# Altium project L4Duino.PrjPcb
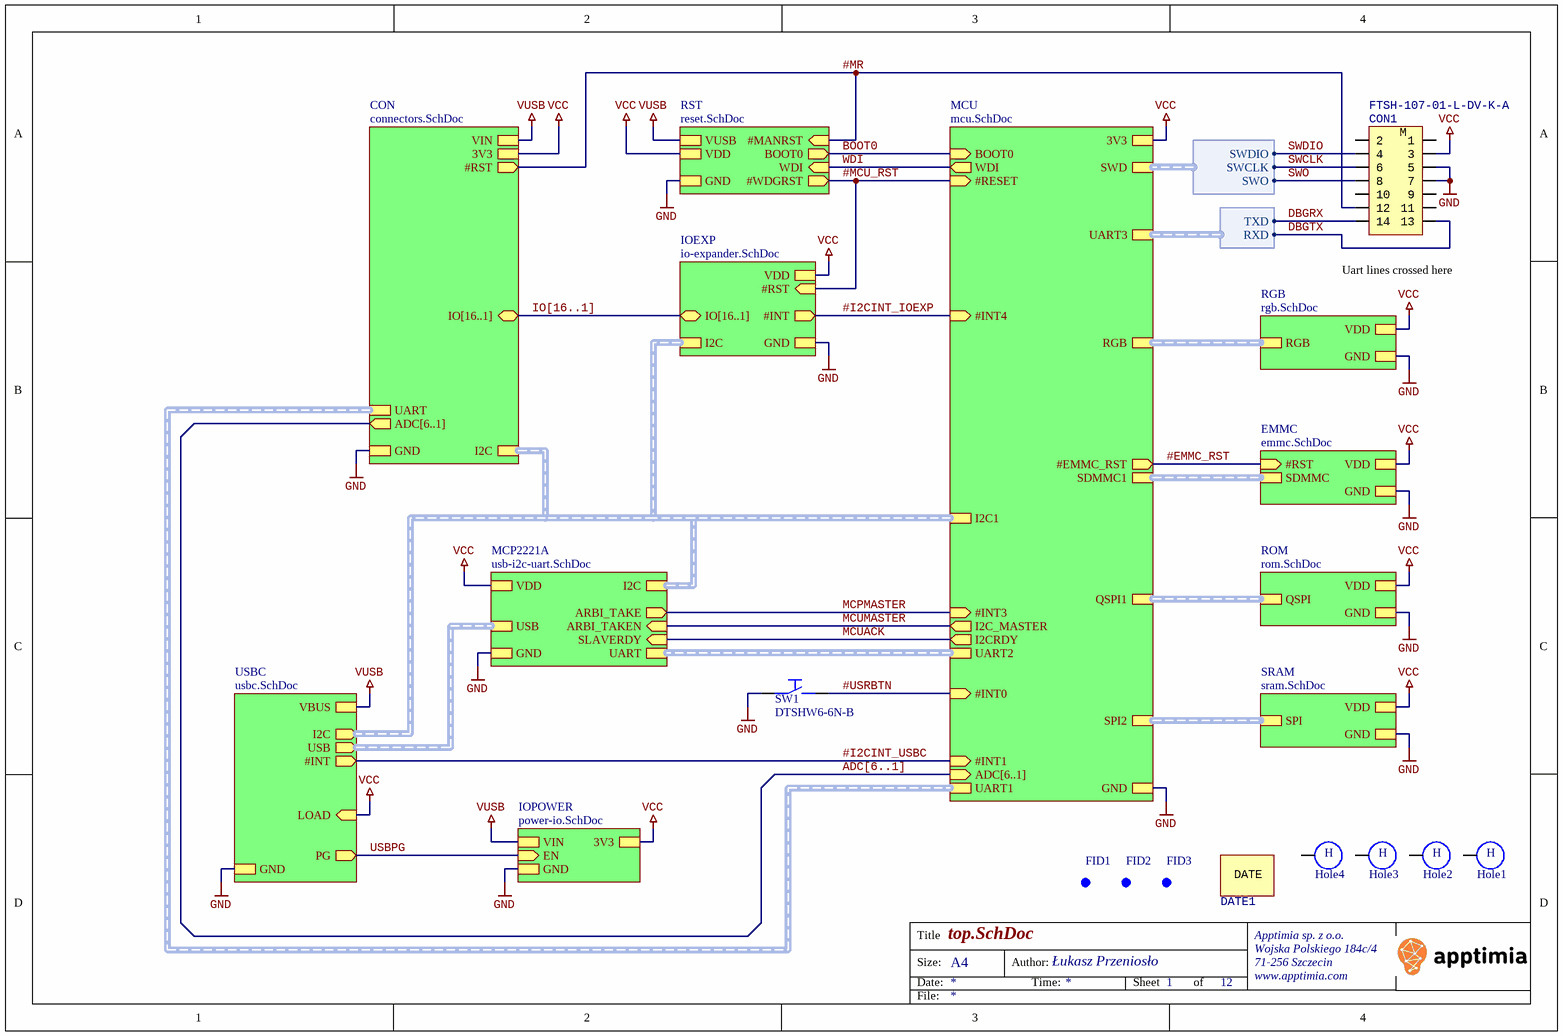
[diagram p0: top.SchDoc]
id: L4Duino; ver: 1
12 sheets, 106 parts. Net scope: strictly hierarchical (ports join the sheet entries above them; power ports are local).
Board file: L4Duino_ver1.PcbDoc
Sheets:
  top.SchDoc
    IOPOWER = power-io.SchDoc
    USBC = usbc.SchDoc
    MCP2221A = usb-i2c-uart.SchDoc
    SRAM = sram.SchDoc
    ROM = rom.SchDoc
    EMMC = emmc.SchDoc
    MCU = mcu.SchDoc
    CON = connectors.SchDoc
    RST = reset.SchDoc
    RGB = rgb.SchDoc
    IOEXP = io-expander.SchDoc

## Sheet top.SchDoc: Test
size A4; DrawnBy: Łukasz Przeniosło; Organization: Apptimia sp. z o.o.; Address1: Wojska Polskiego 184c/4; Address2: 71-256 Szczecin; Address3: www.apptimia.com; DocumentNumber: 1; Revision: 1; SheetNumber: 1; SheetTotal: 12

### Parts
CON1  FTSH-107-01-L-DV-K-A  [CON_SAMTEC_FTSH-107-01-L-DV-K-A]
DATE1  DATE  [DATE]  (value not drawn)
FID1  Fiducial  [Fid Round]  (value not drawn)  (no BOM)
FID2  Fiducial  [Fid Round]  (value not drawn)  (no BOM)
FID3  Fiducial  [Fid Round]  (value not drawn)  (no BOM)
Hole1  Hole  [Hole-4/3.2]  (value not drawn)
Hole2  Hole  [Hole-4/3.2]  (value not drawn)
Hole3  Hole  [Hole-4/3.2]  (value not drawn)
Hole4  Hole  [Hole-4/3.2]  (value not drawn)
SW1  DTSHW6-6N-B  [FSM2J]

### Sub-sheets
CON = connectors.SchDoc: 3V3, VIN, GND, ADC[6..1] (out), I2C (harness I2C), UART (harness UART), #RST (out), IO[16..1] (bidir)
EMMC = emmc.SchDoc: VDD, GND, #RST (in), SDMMC (harness SDIO)
IOEXP = io-expander.SchDoc: GND, VDD, I2C (harness I2C), #RST (in), #INT (out), IO[16..1] (bidir)
IOPOWER = power-io.SchDoc: 3V3, GND, EN (in), VIN
MCP2221A = usb-i2c-uart.SchDoc: GND, VDD, I2C (harness I2C), UART (harness UART), USB (harness USB), ARBI_TAKE (out), ARBI_TAKEN (in), SLAVERDY (in)
MCU = mcu.SchDoc: UART2 (harness UART2), I2C1 (harness I2C1), UART3 (harness UART3), SWD (harness SWD), #RESET (in), UART1 (harness UART1), RGB (harness RGB), GND, 3V3, #INT0 (in), SPI2 (harness SPI2), BOOT0 (in), #EMMC_RST (out), WDI (out), ADC[6..1] (in), #INT1 (in), I2C_MASTER (out), QSPI1 (harness QSPI1), #INT3 (in), SDMMC1 (harness SDMMC1), #INT4 (in), I2CRDY (out)
RGB = rgb.SchDoc: RGB (harness RGB), GND, VDD
ROM = rom.SchDoc: GND, VDD, QSPI (harness QSPI)
RST = reset.SchDoc: GND, VDD, #MANRST (in), #WDGRST (out), WDI (in), BOOT0 (out), VUSB
SRAM = sram.SchDoc: GND, VDD, SPI (harness SPI)
USBC = usbc.SchDoc: USB (out, harness USB), I2C (out, harness I2C), #INT (out), GND, VBUS, PG (out), LOAD (in)

### Harnesses
SWD: SWCLK, SWDIO, SWO
UART3: RXD, TXD

### Nets
GND: CON1.5 CON1.7 SW1.1 ; sheet IOPOWER/GND, sheet USBC/GND, sheet MCP2221A/GND, sheet SRAM/GND, sheet ROM/GND, sheet EMMC/GND, sheet MCU/GND, sheet CON/GND, sheet RST/GND, sheet RGB/GND, sheet IOEXP/GND
VCC: CON1.3 ; sheet IOPOWER/3V3, sheet USBC/LOAD, sheet MCP2221A/VDD, sheet SRAM/VDD, sheet ROM/VDD, sheet EMMC/VDD, sheet MCU/3V3, sheet CON/3V3, sheet RST/VDD, sheet RGB/VDD, sheet IOEXP/VDD
VUSB: sheet IOPOWER/VIN, sheet USBC/VBUS, sheet CON/VIN, sheet RST/VUSB
#EMMC_RST: sheet EMMC/#RST, sheet MCU/#EMMC_RST
#I2CINT_IOEXP: sheet MCU/#INT4, sheet IOEXP/#INT
#I2CINT_USBC: sheet USBC/#INT, sheet MCU/#INT1
#MCU_RST: sheet MCU/#RESET, sheet RST/#WDGRST, sheet IOEXP/#RST
#MR: CON1.12 ; sheet CON/#RST, sheet RST/#MANRST
#USRBTN: SW1.2 ; sheet MCU/#INT0
BOOT0: sheet MCU/BOOT0, sheet RST/BOOT0
DBGRX: CON1.14 ; sheet MCU/UART3.TXD
DBGTX: CON1.13 ; sheet MCU/UART3.RXD
MCPMASTER: sheet MCP2221A/ARBI_TAKE, sheet MCU/#INT3
MCUACK: sheet MCP2221A/SLAVERDY, sheet MCU/I2CRDY
MCUMASTER: sheet MCP2221A/ARBI_TAKEN, sheet MCU/I2C_MASTER
SWCLK: CON1.6 ; sheet MCU/SWD.SWCLK
SWDIO: CON1.4 ; sheet MCU/SWD.SWDIO
SWO: CON1.8 ; sheet MCU/SWD.SWO
USBPG: sheet IOPOWER/EN, sheet USBC/PG
WDI: sheet MCU/WDI, sheet RST/WDI

Not connected (* = marked no-connect by the designer): CON1 1 2 9 10 11; Hole1 1; Hole2 1; Hole3 1; Hole4 1

### Buses and harness runs
bus ADC[6..1] = sheet CON/ADC[6..1] = sheet MCU/ADC[6..1]
bus IO[16..1] = sheet CON/IO[16..1] = sheet IOEXP/IO[16..1]
harness sheet CON/I2C = sheet IOEXP/I2C = sheet MCP2221A/I2C = sheet MCU/I2C1 = sheet USBC/I2C
harness sheet CON/UART = sheet MCU/UART1
harness sheet EMMC/SDMMC = sheet MCU/SDMMC1
harness sheet MCP2221A/UART = sheet MCU/UART2
harness sheet MCP2221A/USB = sheet USBC/USB
harness sheet MCU/QSPI1 = sheet ROM/QSPI
harness sheet MCU/RGB = sheet RGB/RGB
harness sheet MCU/SPI2 = sheet SRAM/SPI

### Notes on the sheet
- (near CON1) Uart lines crossed here
- Title
- Size:
- Date:
- A4
- Author:
- Time:
- Sheet
- of
- File:
- (in symbol FTSH-107-01-L-DV-K-A) M
- (in symbol HOLE_) H

### Library data of the parts
CON1 = FTSH-107-01-L-DV-K-A: Header 7x2, 1.27mm, Dual row, Straight, "STDC14_MEDIUM" : footprint compatible with FTSH-107-01-L-DV,-K,-A,-P,-ES (use "STDC14_BIG" to also be compatible with SHF-107-01-L-D-SM,-K) and FTSH-105-01-L-DV-K (MIPI10); manid: FTSH-107-01-L-DV-K-A
FID1-FID3 = FID
Hole1-Hole4 = HOLE_
SW1 = DTSHW66NB: SWITCH, SPNO TACT; Published: 8-Jun-2000; LatestRevisionDate: 17-Jul-2002; LatestRevisionNote: Re-released for DXP Platform.; PackageDocument: Sep-1998; PackageReference: SOT-23A; Publisher: Altium Limited; ComponentLink1Description: Manufacturer Link; ComponentLink2Description: Datasheet; Distributor: tme.pl; tme.pl: DTSHW66NB; manid: DTSHW6-6N-B

## Sheet power-io.SchDoc: Test
size A4; DrawnBy: Łukasz Przeniosło; Organization: Apptimia sp. z o.o.; Address1: Wojska Polskiego 184c/4; Address2: 71-256 Szczecin; Address3: www.apptimia.com; DocumentNumber: 3; Revision: 1; SheetNumber: 3; SheetTotal: 12
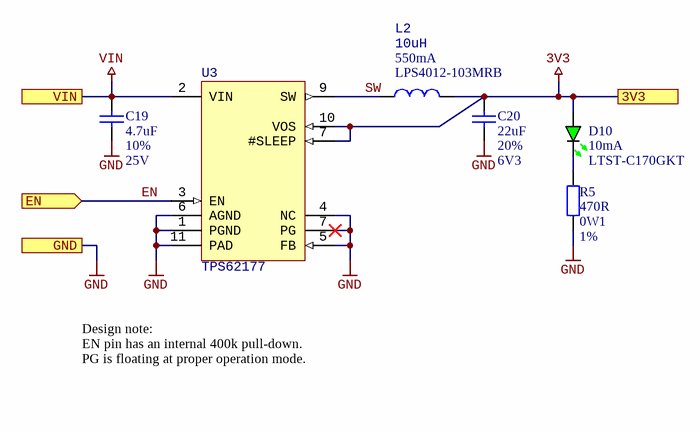
[diagram p1: power-io.SchDoc]

### Parts
C19  4.7uF  Tolerance: 10%  Voltage: 25V  [CAPC2012N]
C20  22uF  Tolerance: 20%  Voltage: 6V3  [CAPC2012N]
D10  Current: 10mA  manid: LTST-C170GKT  [CD2012-0805-GRN]  (hidden comment: Led Green)
L2  10uH  Current: 550mA  manid: LPS4012-103MRB  [LPS4012]
R5  470R  Power: 0W1  Tolerance: 1%  [RESC1608N]
U3  TPS62177  [WSON10]

### Ports
3V3, EN (in), GND, VIN

### Nets
3V3: C20.2 D10.1(A) L2.1 U3.7(#SLEEP) U3.10(VOS) ; port 3V3  [project net VCC]
GND: C19.1 C20.1 R5.1 U3.1(PGND) U3.4(NC) U3.5(FB) U3.6(AGND) U3.7(PG) U3.11(PAD) ; port GND
VIN: C19.2 U3.2(VIN) ; port VIN  [project net VUSB]
EN: U3.3(EN) ; port EN  [project net USBPG]
SW: L2.2 U3.9(SW)
NetD10_2: D10.2(K) R5.2

### Notes on the sheet
- Design note:
  EN pin has an internal 400k pull-down.
  PG is floating at proper operation mode.
- Title
- Size:
- Date:
- A4
- Author:
- Time:
- Sheet
- of
- File:

### Library data of the parts
C19 C20 = Capacitor
  C19: Value: 4.7uF
  C20: Value: 22uF
D10 = Led Green: Typical GRN LED
L2 = Inductor: Impedance_100Mhz: 40R; Value: 10uH
R5 = Resistor: Value: 470R
U3 = TPS6217x: TPS6217x 28-V, 0.5-A Step-Down Converter With Sleep Mode; manid: TPS62177

## Sheet usbc.SchDoc: Test
size A4; DrawnBy: Łukasz Przeniosło; Organization: Apptimia sp. z o.o.; Address1: Wojska Polskiego 184c/4; Address2: 71-256 Szczecin; Address3: www.apptimia.com; DocumentNumber: 4; Revision: 1; SheetNumber: 4; SheetTotal: 12
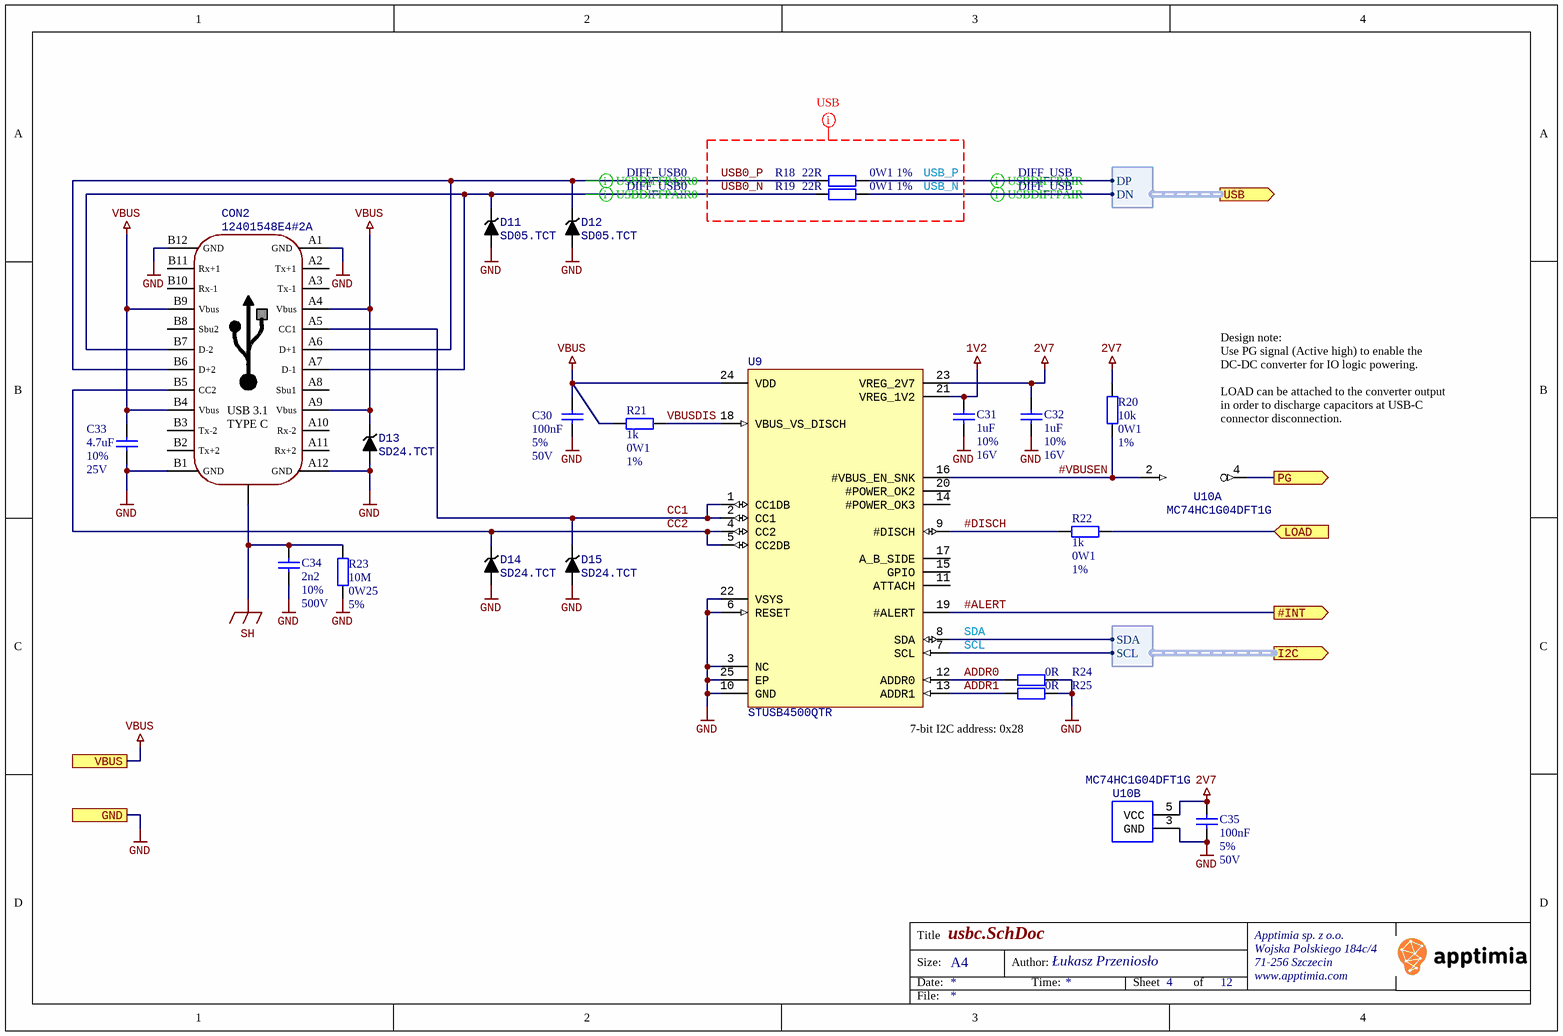
[diagram p2: usbc.SchDoc]

### Parts
C30  100nF  Tolerance: 5%  Voltage: 50V  [CAPC1608N]
C31  1uF  Tolerance: 10%  Voltage: 16V  [CAPC1608N]
C32  1uF  Tolerance: 10%  Voltage: 16V  [CAPC1608N]
C33  4.7uF  Tolerance: 10%  Voltage: 25V  [CAPC2012N]
C34  2n2  Tolerance: 10%  Voltage: 500V  [CAPC3216N]
C35  100nF  Tolerance: 5%  Voltage: 50V  [CAPC1608N]
CON2  12401548E4#2A  [12401548E4#2A]
D11  SD05.TCT  [SOD323]
D12  SD05.TCT  [SOD323]
D13  SD24.TCT  [SOD323]
D14  SD24.TCT  [SOD323]
D15  SD24.TCT  [SOD323]
R18  22R  Power: 0W1  Tolerance: 1%  [RESC1608N]
R19  22R  Power: 0W1  Tolerance: 1%  [RESC1608N]
R20  10k  Power: 0W1  Tolerance: 1%  [RESC1608N]
R21  1k  Power: 0W1  Tolerance: 1%  [RESC1608N]
R22  1k  Power: 0W1  Tolerance: 1%  [RESC1608N]
R23  10M  Power: 0W25  Tolerance: 5%  [RESC3216N]
R24  0R  [RESC1005N]
R25  0R  [RESC1005N]
U9  STUSB4500QTR  [QFN24-4mmx4mm]
U10  MC74HC1G04DFT1G  [sc70]  (parts A,B of 2)

### Ports
#INT (out), GND, I2C (out, harness I2C), LOAD (in), PG (out), USB (out, harness USB), VBUS

### Harnesses
USB: DN, DP
I2C: SCL, SDA

### Nets
1V2: C31.2 U9.21(VREG_1V2)
2V7: C32.2 C35.1 R20.2 U9.23(VREG_2V7) U10.5(VCC)
GND: C30.2 C31.1 C32.1 C33.1 C34.1 C35.2 CON2.A1(GND) CON2.A12(GND) CON2.B1(GND) CON2.B12(GND) D11.1 D12.1 D13.1 D14.1 D15.1 R23.1 R24.1 R25.1 U9.3(NC) U9.6(RESET) U9.10(GND) U9.22(VSYS) U9.25(EP) U10.3(GND) ; port GND
SH: C34.2 CON2.SH R23.2
VBUS: C30.1 C33.2 CON2.A4(Vbus) CON2.A9(Vbus) CON2.B4(Vbus) CON2.B9(Vbus) D13.2 R21.1 U9.24(VDD) ; port VBUS  [project net VUSB]
VCC: R22.2 ; port LOAD
#ALERT: U9.19(#ALERT) ; port #INT  [project net #I2CINT_USBC]
#DISCH: R22.1 U9.9(#DISCH)
#VBUSEN: R20.1 U9.16(#VBUS_EN_SNK) U10.2(A)
ADDR0: R24.2 U9.12(ADDR0)
ADDR1: R25.2 U9.13(ADDR1)
CC1: CON2.A5(CC1) D15.2 U9.1(CC1DB) U9.2(CC1)
CC2: CON2.B5(CC2) D14.2 U9.4(CC2) U9.5(CC2DB)
SCL: U9.7(SCL) ; port I2C.SCL  [project net CON_SCL]
SDA: U9.8(SDA) ; port I2C.SDA  [project net CON_SDA]
USB0_N: CON2.A7(D-1) CON2.B7(D-2) D11.2 R19.2
USB0_P: CON2.A6(D+1) CON2.B6(D+2) D12.2 R18.2
USB_N: R19.1 ; port USB.DN
USB_P: R18.1 ; port USB.DP
USBPG: U10.4(Y) ; port PG
VBUSDIS: R21.2 U9.18(VBUS_VS_DISCH)

Not connected (* = marked no-connect by the designer): CON2 A2(Tx+1) A3(Tx-1) A8(Sbu1) A10(Rx-2) A11(Rx+2) B2(Tx+2) B3(Tx-2) B8(Sbu2) B10(Rx-1) B11(Rx+1); U9 11(ATTACH) 14(#POWER_OK3) 15(GPIO) 17(A_B_SIDE) 20(#POWER_OK2); U10 1(NC)

### Layout directives
rule Matched Net Lengths [Tolerance = 2mm]; rule Impedance Constraint [Min = 85.00    Max = 95.00    ]; net class USB_RULE: USB0_N, USB0_P, USB_N, USB_P
differential pair; net class DIFF_USB: USB_N, USB_P
differential pair; net class DIFF_USB0: USB0_N, USB0_P

### Notes on the sheet
- Design note:
  Use PG signal (Active high) to enable the DC-DC converter for IO logic powering.
  LOAD can be attached to the converter output in order to discharge capacitors at USB-C connector disconnection.
- 7-bit I2C address: 0x28
- Title
- Size:
- Date:
- A4
- Author:
- Time:
- Sheet
- of
- File:
- (in symbol 12401548E4#2A) USB 3.1; TYPE C

### Library data of the parts
C30-C35 = Capacitor
  C30 C35: Value: 100nF
  C31 C32: Value: 1uF
  C33: Value: 4.7uF
  C34: Value: 2n2
CON2 = 12401548E4#2A: Gniazdo; USB C; SMT, THT; kątowe 90°, poziome; V: USB 3.1; złocony; manid: 12401548E4#2A
D11-D15 = ESD_PROT_UNI
  D11 D12: manid: SD05.TCT
  D13-D15: manid: SD24.TCT
R18-R23 = Resistor
  R18 R19: Value: 22R
  R20: Value: 10k
  R21 R22: Value: 1k
  R23: Value: 10M
R24 R25 = Resistor: Power: 0W1; Tolerance: 5%; Value: 0R
U9 = STUSB4500: Standalone USB PD sink controller with short-to-VBUS protections; manid: STUSB4500QTR
U10 = NC7SP04: tiny logic inverter; manid: MC74HC1G04DFT1G

## Sheet usb-i2c-uart.SchDoc: Test
size A4; DrawnBy: Łukasz Przeniosło; Organization: Apptimia sp. z o.o.; Address1: Wojska Polskiego 184c/4; Address2: 71-256 Szczecin; Address3: www.apptimia.com; DocumentNumber: 5; Revision: 1; SheetNumber: 5; SheetTotal: 12
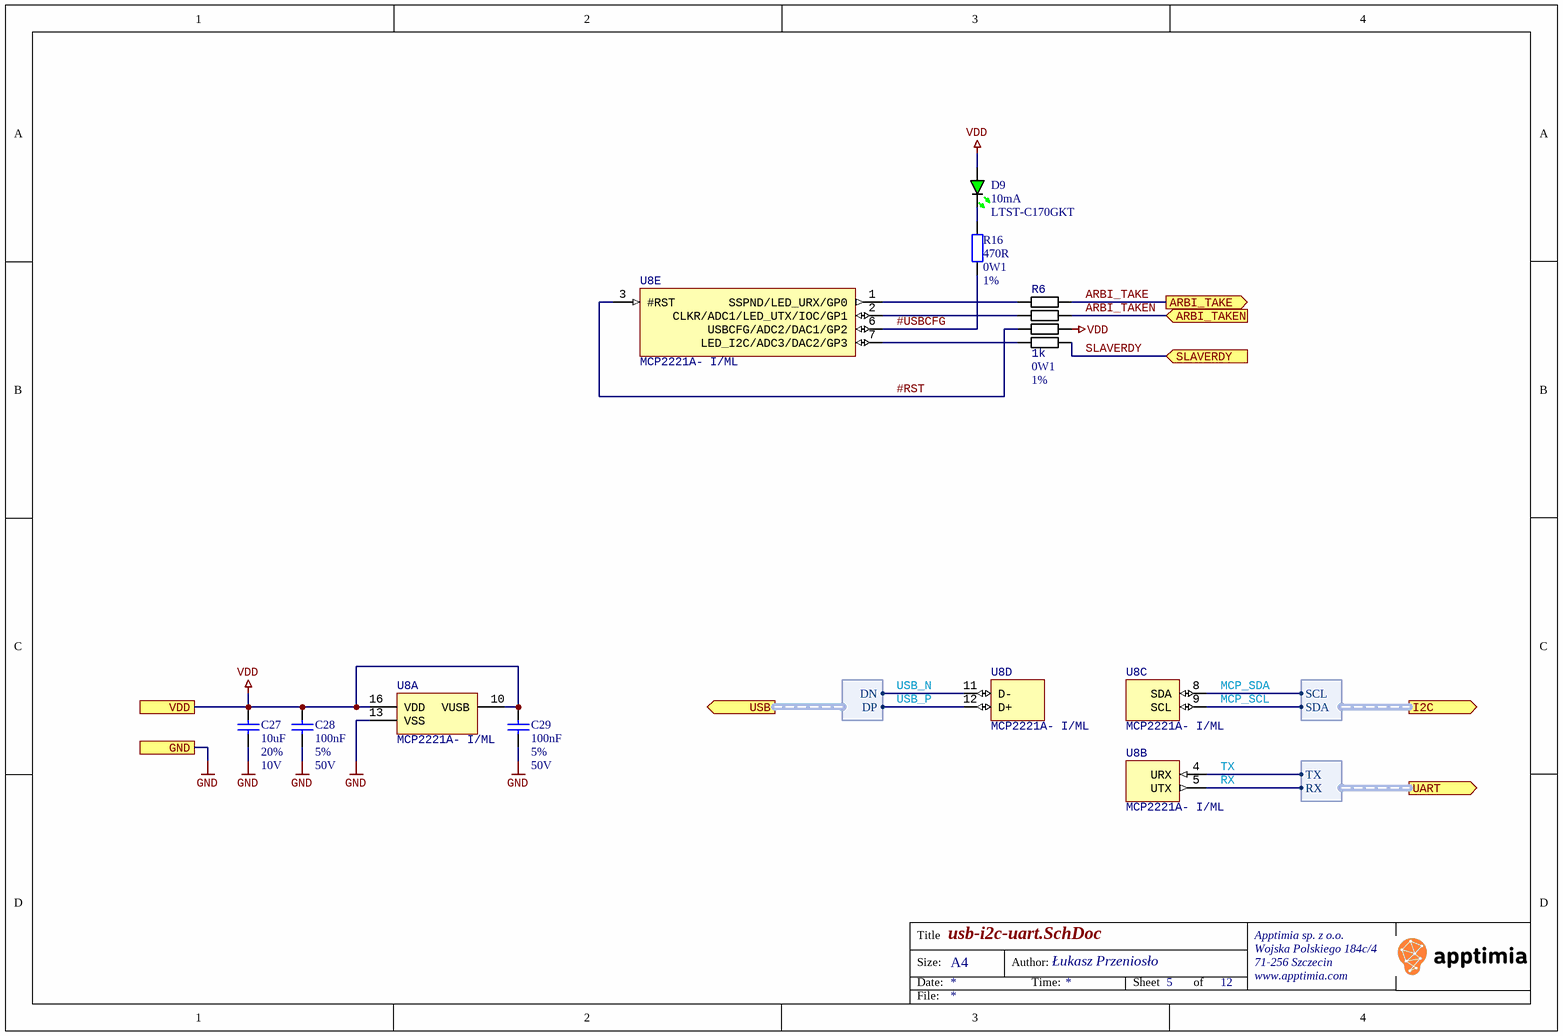
[diagram p3: usb-i2c-uart.SchDoc]

### Parts
C27  10uF  Tolerance: 20%  Voltage: 10V  [CAPC1608N]
C28  100nF  Tolerance: 5%  Voltage: 50V  [CAPC1608N]
C29  100nF  Tolerance: 5%  Voltage: 50V  [CAPC1608N]
D9  Current: 10mA  manid: LTST-C170GKT  [CD2012-0805-GRN]  (hidden comment: Led Green)
R6  1k  Power: 0W1  Tolerance: 1%  [RES_ARRAY_4x0603]
R16  470R  Power: 0W1  Tolerance: 1%  [RESC1608N]
U8  MCP2221A- I/ML  [QFN16_4x4]  (parts A,B,C,D,E of 5)

### Ports
ARBI_TAKE (out), ARBI_TAKEN (in), GND, I2C (out, harness I2C), SLAVERDY (in), UART (out, harness UART), USB (out, harness USB), VDD

### Harnesses
I2C: SCL, SDA
UART: RX, TX
USB: DN, DP

### Nets
GND: C27.1 C28.1 C29.1 U8.13(VSS) ; port GND
VDD: C27.2 C28.2 C29.2 D9.1(A) R6.4 U8.10(VUSB) U8.16(VDD) ; port VDD  [project net VCC]
#RST: R6.3 U8.3(#RST)
#USBCFG: R16.1 U8.6(USBCFG/ADC2/DAC1/GP2)
ARBI_TAKE: R6.8 ; port ARBI_TAKE  [project net MCPMASTER]
ARBI_TAKEN: R6.6 ; port ARBI_TAKEN  [project net MCUMASTER]
MCP_SCL: U8.9(SCL) ; port I2C.SDA  [project net CON_SDA]
MCP_SDA: U8.8(SDA) ; port I2C.SCL  [project net CON_SCL]
RX: U8.5(UTX) ; port UART.RX
SLAVERDY: R6.2 ; port SLAVERDY  [project net MCUACK]
TX: U8.4(URX) ; port UART.TX
USB_N: U8.11(D-) ; port USB.DN
USB_P: U8.12(D+) ; port USB.DP
NetD9_2: D9.2(K) R16.2
NetR6_1: R6.1 U8.7(LED_I2C/ADC3/DAC2/GP3)
NetR6_5: R6.5 U8.2(CLKR/ADC1/LED_UTX/IOC/GP1)
NetR6_7: R6.7 U8.1(SSPND/LED_URX/GP0)

Not connected (* = marked no-connect by the designer): U8 14(NC) 15(NC)

### Notes on the sheet
- Title
- Size:
- Date:
- A4
- Author:
- Time:
- Sheet
- of
- File:

### Library data of the parts
C27-C29 = Capacitor
  C27: Value: 10uF
  C28 C29: Value: 100nF
D9 = Led Green: Typical GRN LED
R6 = RES_ARRAY_1206: value: 1k
R16 = Resistor: Value: 470R
U8 = MCP2221A- I/ML: USB 2.0 to I2C/UART Protocol Converter with GPIO; manid: MCP2221A- I/ML

## Sheet sram.SchDoc: Test
size A4; DrawnBy: Łukasz Przeniosło; Organization: Apptimia sp. z o.o.; Address1: Wojska Polskiego 184c/4; Address2: 71-256 Szczecin; Address3: www.apptimia.com; DocumentNumber: 6; Revision: 1; SheetNumber: 6; SheetTotal: 12
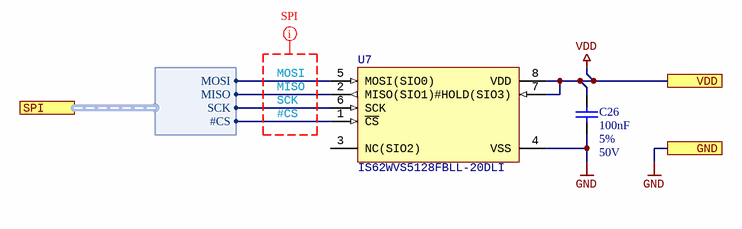
[diagram p4: sram.SchDoc]

### Parts
C26  100nF  Tolerance: 5%  Voltage: 50V  [CAPC1608N]
U7  IS62WVS5128FBLL-20DLI  [SO-8_L]

### Ports
GND, SPI (harness SPI), VDD

### Harnesses
SPI: MOSI, MISO, SCK, #CS

### Nets
GND: C26.1 U7.4(VSS) ; port GND
VDD: C26.2 U7.7(#HOLD(SIO3)) U7.8(VDD) ; port VDD  [project net VCC]
#CS: U7.1(~{CS}) ; port SPI.#CS
MISO: U7.2(MISO(SIO1)) ; port SPI.MISO
MOSI: U7.5(MOSI(SIO0)) ; port SPI.MOSI
SCK: U7.6(SCK) ; port SPI.SCK

Not connected (* = marked no-connect by the designer): U7 3(NC)

### Layout directives
net class SPI: #CS, MISO, MOSI, SCK

### Notes on the sheet
- Title
- Size:
- Date:
- A4
- Author:
- Time:
- Sheet
- of
- File:

### Library data of the parts
C26 = Capacitor: Value: 100nF
U7 = IS62WVS5128FBLL-20xLI: 512Kx8 LOW VOLTAGE, SERIAL SRAM with SPI, SDI and SQI INTERFACE; manid: IS62WVS5128FBLL-20DLI

## Sheet rom.SchDoc: Test
size A4; DrawnBy: Łukasz Przeniosło; Organization: Apptimia sp. z o.o.; Address1: Wojska Polskiego 184c/4; Address2: 71-256 Szczecin; Address3: www.apptimia.com; DocumentNumber: 7; Revision: 1; SheetNumber: 7; SheetTotal: 12
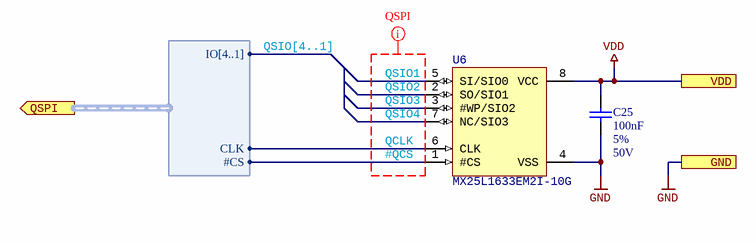
[diagram p5: rom.SchDoc]

### Parts
C25  100nF  Tolerance: 5%  Voltage: 50V  [CAPC1608N]
U6  MX25L1633EM2I-10G  [SOIC-8-WIDE]

### Ports
GND, QSPI (out, harness QSPI), VDD

### Harnesses
QSPI: IO[4..1], CLK, #CS

### Nets
GND: C25.1 U6.4(VSS) ; port GND
VDD: C25.2 U6.8(VCC) ; port VDD  [project net VCC]
#QCS: U6.1(#CS) ; port QSPI.#CS
QCLK: U6.6(CLK) ; port QSPI.CLK
QSIO1: U6.5(SI/SIO0)
QSIO2: U6.2(SO/SIO1)
QSIO3: U6.3(#WP/SIO2)
QSIO4: U6.7(NC/SIO3)

### Buses and harness runs
bus QSIO[4..1]

### Layout directives
net class QSPI: #QCS, QCLK, QSIO1, QSIO2, QSIO3, QSIO4

### Notes on the sheet
- Title
- Size:
- Date:
- A4
- Author:
- Time:
- Sheet
- of
- File:

### Library data of the parts
C25 = Capacitor: Value: 100nF
U6 = MX25L1633E: 16M-BIT [x 1/x 2/x 4] CMOS MXSMIO  (SERIAL MULTI I/O) FLASH MEMORY; manid: MX25L1633EM2I-10G

## Sheet emmc.SchDoc: Test
size A4; DrawnBy: Łukasz Przeniosło; Organization: Apptimia sp. z o.o.; Address1: Wojska Polskiego 184c/4; Address2: 71-256 Szczecin; Address3: www.apptimia.com; DocumentNumber: 8; Revision: 1; SheetNumber: 8; SheetTotal: 12
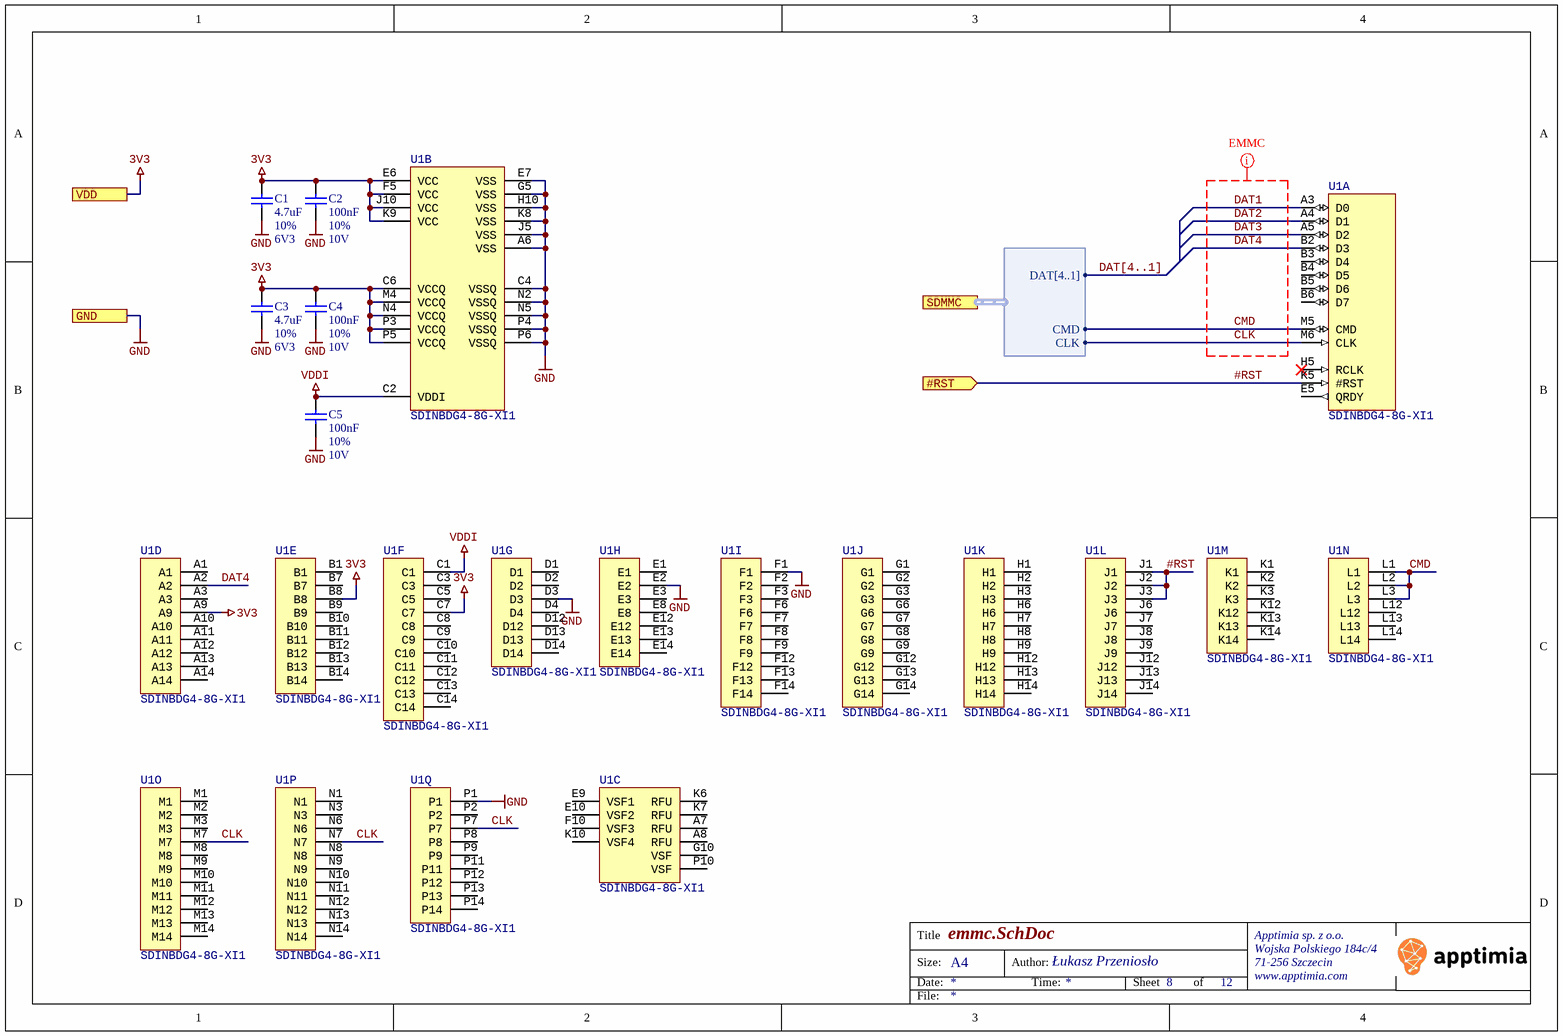
[diagram p6: emmc.SchDoc]

### Parts
C1  4.7uF  Tolerance: 10%  Voltage: 6V3  [CAPC1608N]
C2  100nF  Tolerance: 10%  Voltage: 10V  [CAPC1005N]
C3  4.7uF  Tolerance: 10%  Voltage: 6V3  [CAPC1608N]
C4  100nF  Tolerance: 10%  Voltage: 10V  [CAPC1005N]
C5  100nF  Tolerance: 10%  Voltage: 10V  [CAPC1005N]
U1  SDINBDG4-8G-XI1  [BGA153]  (parts A,B,C,D,E,F,G,H,I,J,K,L,M,N,O,P,Q of 17)

### Ports
#RST (in), GND, SDMMC (harness SDIO), VDD

### Harnesses
SDIO: DAT[4..1], CMD, CLK

### Nets
3V3: C1.2 C2.2 C3.2 C4.2 U1.A9 U1.B8 U1.C6(VCCQ) U1.C7 U1.E6(VCC) U1.F5(VCC) U1.J10(VCC) U1.K9(VCC) U1.M4(VCCQ) U1.N4(VCCQ) U1.P3(VCCQ) U1.P5(VCCQ) ; port VDD  [project net VCC]
GND: C1.1 C2.1 C3.1 C4.1 C5.1 U1.A6(VSS) U1.C4(VSSQ) U1.D3 U1.E2 U1.E7(VSS) U1.F1 U1.G5(VSS) U1.H10(VSS) U1.J5(VSS) U1.K8(VSS) U1.N2(VSSQ) U1.N5(VSSQ) U1.P1 U1.P4(VSSQ) U1.P6(VSSQ) ; port GND
VDDI: C5.2 U1.C1 U1.C2(VDDI)
#RST: U1.J1 U1.J2 U1.J3 U1.K5(#RST) ; port #RST  [project net #EMMC_RST]
CLK: U1.M6(CLK) U1.M7 U1.N7 U1.P7 ; port SDMMC.CLK
CMD: U1.L1 U1.L2 U1.L3 U1.M5(CMD) ; port SDMMC.CMD
DAT1: U1.A3(D0)
DAT2: U1.A4(D1)
DAT3: U1.A5(D2)
DAT4: U1.A2 U1.B2(D3)

Not connected (* = marked no-connect by the designer): U1 A1 A7(RFU) A8(RFU) A10 A11 A12 A13 A14 B1 B3(D4) B4(D5) B5(D6) B6(D7) B7 B9 B10 B11 B12 B13 B14 C3 C5 C8 C9 C10 C11 C12 C13 C14 D1 D2 D4 D12 D13 D14 E1 E3 E5(QRDY) E8 E9(VSF1) E10(VSF2) E12 E13 E14 F2 F3 F6 F7 F8 F9 F10(VSF3) F12 F13 F14 G1 G2 G3 G6 G7 G8 G9 G10(VSF) G12 G13 G14 H1 H2 H3 H5(RCLK)* H6 H7 H8 H9 H12 H13 H14 J6 J7 J8 J9 J12 J13 J14 K1 K2 K3 K6(RFU) K7(RFU) K10(VSF4) K12 K13 K14 L12 L13 L14 M1 M2 M3 M8 M9 M10 M11 M12 M13 M14 N1 N3 N6 N8 N9 N10 N11 N12 N13 N14 P2 P8 P9 P10(VSF) P11 P12 P13 P14

### Buses and harness runs
bus DAT[4..1]

### Layout directives
rule Matched Net Lengths [Tolerance = 0.5mm]; rule Impedance Constraint [Min = 40.00    Max = 60.00    ]; net class EMMC_RULE: CLK, CMD, DAT1, DAT2, DAT3, DAT4

### Notes on the sheet
- Title
- Size:
- Date:
- A4
- Author:
- Time:
- Sheet
- of
- File:

### Library data of the parts
C1-C5 = Capacitor
  C1 C3: Value: 4.7uF
  C2 C4 C5: Value: 100nF
U1 = eMMC_5.x: eMMC 5.x chip; manid: SDINBDG4-8G-XI1

## Sheet mcu.SchDoc: Test
size A4; DrawnBy: Łukasz Przeniosło; Organization: Apptimia sp. z o.o.; Address1: Wojska Polskiego 184c/4; Address2: 71-256 Szczecin; Address3: www.apptimia.com; DocumentNumber: 9; Revision: 1; SheetNumber: 9; SheetTotal: 12
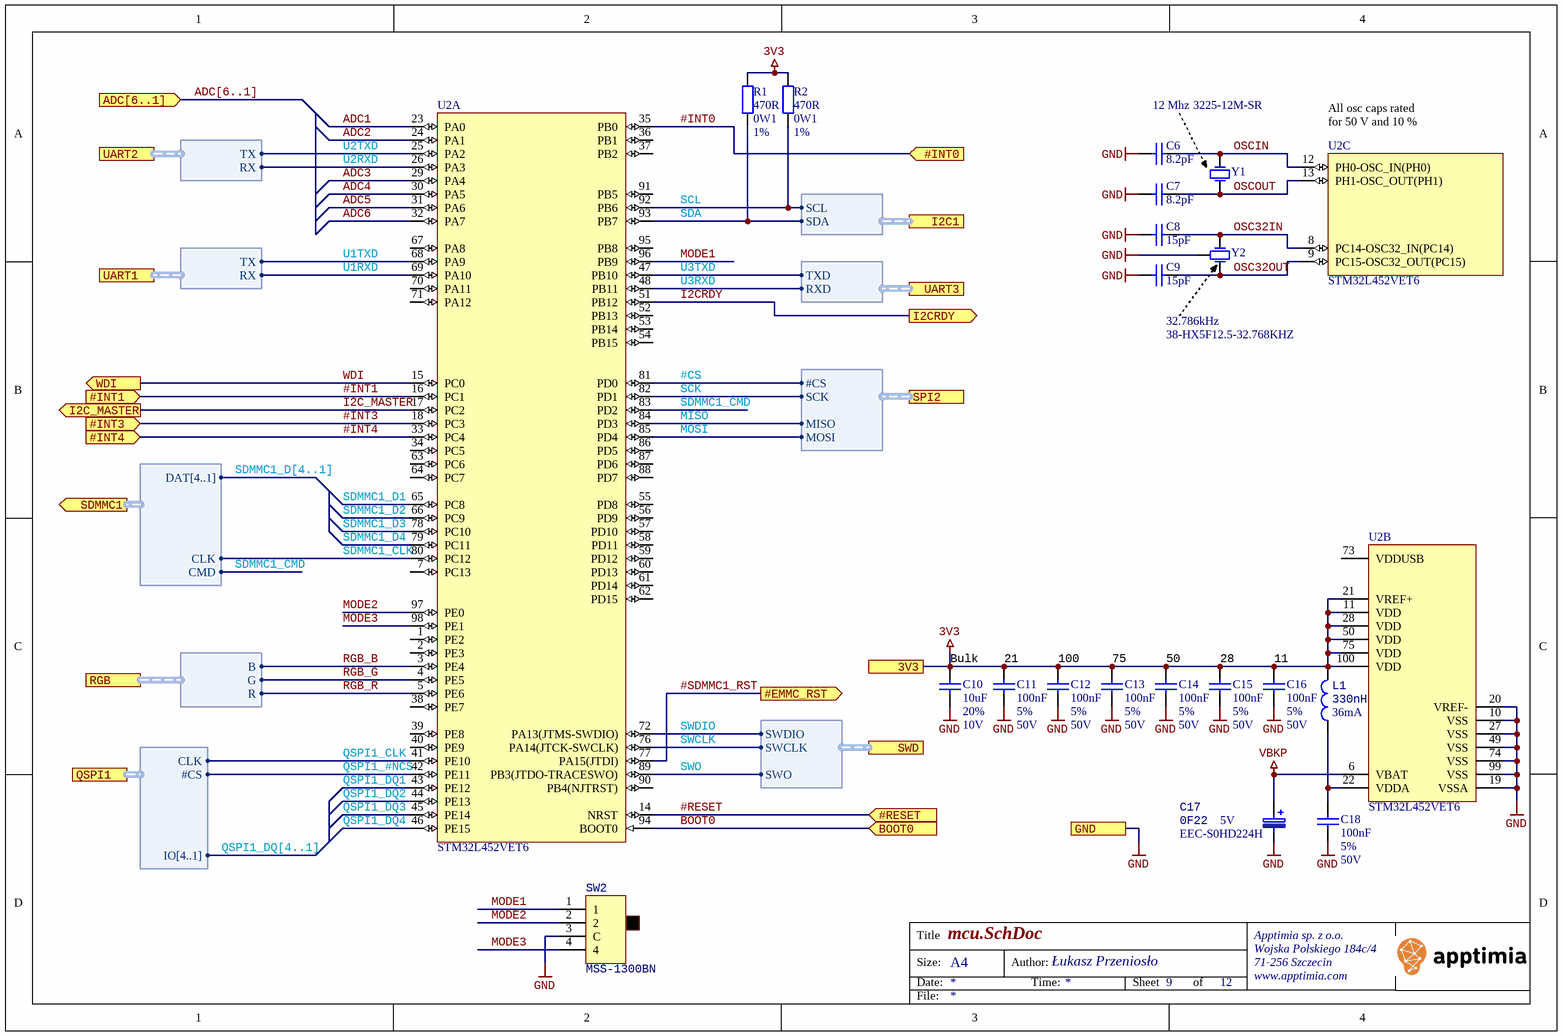
[diagram p7: mcu.SchDoc]

### Parts
C6  8.2pF  [CAPC1608N]
C7  8.2pF  [CAPC1608N]
C8  15pF  [CAPC1608N]
C9  15pF  [CAPC1608N]
C10  10uF  Tolerance: 20%  Voltage: 10V  [CAPC1608N]
C11  100nF  Tolerance: 5%  Voltage: 50V  [CAPC1608N]
C12  100nF  Tolerance: 5%  Voltage: 50V  [CAPC1608N]
C13  100nF  Tolerance: 5%  Voltage: 50V  [CAPC1608N]
C14  100nF  Tolerance: 5%  Voltage: 50V  [CAPC1608N]
C15  100nF  Tolerance: 5%  Voltage: 50V  [CAPC1608N]
C16  100nF  Tolerance: 5%  Voltage: 50V  [CAPC1608N]
C17  0F22  manid: EEC-S0HD224H  Voltage: 5V  [CAP_SD]
C18  100nF  Tolerance: 5%  Voltage: 50V  [CAPC1608N]
L1  330nH  Current: 36mA  [INDC1608N]
R1  470R  Power: 0W1  Tolerance: 1%  [RESC1608N]
R2  470R  Power: 0W1  Tolerance: 1%  [RESC1608N]
SW2  MSS-1300BN  [MSS-1300BN]
U2  STM32L452VET6  [LQFP100_L]  (parts A,B,C of 3)
Y1  3225-12M-SR  value 12 Mhz  [3325]
Y2  38-HX5F12.5-32.768KHZ  value 32.786kHz  [XTAL_32k_pad]

### Ports
3V3, #EMMC_RST (out), #INT0 (in), #INT1 (in), #INT3 (in), #INT4 (in), #RESET (in), ADC[6..1] (in), BOOT0 (in), GND, I2C1 (harness I2C1), I2C_MASTER (out), I2CRDY (out), QSPI1 (harness QSPI1), RGB (harness RGB), SDMMC1 (out, harness SDMMC1), SPI2 (harness SPI2), SWD (harness SWD), UART1 (harness UART1), UART2 (harness UART2), UART3 (harness UART3), WDI (out)

### Harnesses
UART2: TX, RX
I2C1: SDA, SCL
QSPI1: CLK, #CS, IO[4..1]
UART3: TXD, RXD
SWD: SWCLK, SWDIO, SWO
UART1: RX, TX
RGB: B, G, R
SPI2: MOSI, MISO, SCK, #CS
SDMMC1: CLK, CMD, DAT[4..1]

### Nets
3V3: C10.2 C11.2 C12.2 C13.2 C14.2 C15.2 C16.2 L1.1 R1.2 R2.2 U2.11(VDD) U2.21(VREF+) U2.28(VDD) U2.50(VDD) U2.75(VDD) U2.100(VDD) ; port 3V3  [project net VCC]
GND: C6.2 C7.2 C8.2 C9.2 C10.1 C11.1 C12.1 C13.1 C14.1 C15.1 C16.1 C17.2 C18.1 SW2.3(C) U2.10(VSS) U2.19(VSSA) U2.20(VREF-) U2.27(VSS) U2.49(VSS) U2.74(VSS) U2.99(VSS) Y2.3(PAD) ; port GND
VBKP: C17.1 U2.6(VBAT)
#CS: U2.81(PD0) ; port SPI2.#CS
#INT0: U2.35(PB0) ; port #INT0  [project net #USRBTN]
#INT1: U2.16(PC1) ; port #INT1  [project net #I2CINT_USBC]
#INT3: U2.18(PC3) ; port #INT3  [project net MCPMASTER]
#INT4: U2.33(PC4) ; port #INT4  [project net #I2CINT_IOEXP]
#RESET: U2.14(NRST) ; port #RESET  [project net #MCU_RST]
#SDMMC1_RST: U2.77(PA15(JTDI)) ; port #EMMC_RST  [project net #EMMC_RST]
ADC1: U2.23(PA0)
ADC2: U2.24(PA1)
ADC3: U2.29(PA4)
ADC4: U2.30(PA5)
ADC5: U2.31(PA6)
ADC6: U2.32(PA7)
BOOT0: U2.94(BOOT0) ; port BOOT0
I2C_MASTER: U2.17(PC2) ; port I2C_MASTER  [project net MCUMASTER]
I2CRDY: U2.51(PB12) ; port I2CRDY  [project net MCUACK]
MISO: U2.84(PD3) ; port SPI2.MISO
MODE1: SW2.1 U2.96(PB9)
MODE2: SW2.2 U2.97(PE0)
MODE3: SW2.4 U2.98(PE1)
MOSI: U2.85(PD4) ; port SPI2.MOSI
OSC32IN: C8.1 U2.8(PC14-OSC32_IN(PC14)) Y2.2(OSC2)
OSC32OUT: C9.1 U2.9(PC15-OSC32_OUT(PC15)) Y2.1(OSC1)
OSCIN: C6.1 U2.12(PH0-OSC_IN(PH0)) Y1.3(OSC2)
OSCOUT: C7.1 U2.13(PH1-OSC_OUT(PH1)) Y1.1(OSC1)
QSPI1_#NCS: U2.42(PE11) ; port QSPI1.#CS  [project net #QCS]
QSPI1_CLK: U2.41(PE10) ; port QSPI1.CLK  [project net QCLK]
QSPI1_DQ1: U2.43(PE12)  [project net QSIO1]
QSPI1_DQ2: U2.44(PE13)  [project net QSIO2]
QSPI1_DQ3: U2.45(PE14)  [project net QSIO3]
QSPI1_DQ4: U2.46(PE15)  [project net QSIO4]
RGB_B: U2.3(PE4) ; port RGB.B  [project net B]
RGB_G: U2.4(PE5) ; port RGB.G  [project net G]
RGB_R: U2.5(PE6) ; port RGB.R  [project net R]
SCK: U2.82(PD1) ; port SPI2.SCK
SCL: R2.1 U2.92(PB6) ; port I2C1.SCL  [project net CON_SCL]
SDA: R1.1 U2.93(PB7) ; port I2C1.SDA  [project net CON_SDA]
SDMMC1_CLK: U2.80(PC12) ; port SDMMC1.CLK  [project net CLK]
SDMMC1_CMD: U2.83(PD2) ; port SDMMC1.CMD  [project net CMD]
SDMMC1_D1: U2.65(PC8)  [project net DAT1]
SDMMC1_D2: U2.66(PC9)  [project net DAT2]
SDMMC1_D3: U2.78(PC10)  [project net DAT3]
SDMMC1_D4: U2.79(PC11)  [project net DAT4]
SWCLK: U2.76(PA14(JTCK-SWCLK)) ; port SWD.SWCLK
SWDIO: U2.72(PA13(JTMS-SWDIO)) ; port SWD.SWDIO
SWO: U2.89(PB3(JTDO-TRACESWO)) ; port SWD.SWO
U1RXD: U2.69(PA10) ; port UART1.RX  [project net CON_RX]
U1TXD: U2.68(PA9) ; port UART1.TX  [project net CON_TX]
U2RXD: U2.26(PA3) ; port UART2.RX  [project net RX]
U2TXD: U2.25(PA2) ; port UART2.TX  [project net TX]
U3RXD: U2.48(PB11) ; port UART3.RXD  [project net DBGTX]
U3TXD: U2.47(PB10) ; port UART3.TXD  [project net DBGRX]
WDI: U2.15(PC0) ; port WDI
NetC18_2: C18.2 L1.2 U2.22(VDDA)

Not connected (* = marked no-connect by the designer): U2 1(PE2) 2(PE3) 7(PC13) 34(PC5) 36(PB1) 37(PB2) 38(PE7) 39(PE8) 40(PE9) 52(PB13) 53(PB14) 54(PB15) 55(PD8) 56(PD9) 57(PD10) 58(PD11) 59(PD12) 60(PD13) 61(PD14) 62(PD15) 63(PC6) 64(PC7) 67(PA8) 70(PA11) 71(PA12) 73(VDDUSB) 86(PD5) 87(PD6) 88(PD7) 90(PB4(NJTRST)) 91(PB5) 95(PB8); Y1 2 4

### Buses and harness runs
bus ADC[6..1] = port ADC[6..1]
bus QSPI1_DQ[4..1]
bus SDMMC1_D[4..1]

### Notes on the sheet
- (near U2) All osc caps rated for 50 V and 10 %
- (near C10) Bulk
- (near C11) 21
- (near C12) 100
- (near C13) 75
- (near C14) 50
- (near C15) 28
- (near C16) 11
- Title
- Size:
- Date:
- A4
- Author:
- Time:
- Sheet
- of
- File:

### Library data of the parts
C6-C9 = Capacitor: Tolerance: 10%; Voltage: 50V
  C6 C7: Value: 8.2pF
  C8 C9: Value: 15pF
C10-C16 C18 = Capacitor
  C10: Value: 10uF
  C11-C16 C18: Value: 100nF
C17 = cap_electro: Tolerance: 30%; Value: 0F22
L1 = Inductor: Impedance_100Mhz: 220R; Value: 330nH
R1 R2 = Resistor: Value: 470R
SW2 = MSS-1300BN: Przełącznik: suwakowy; 3-pozycyjne; SP3T; 0,3A/4VDC; OFF-ON-ON
U2 = STM32L452V: Ultra-Low-Power ARM Cortex-M4 32-bit MCU+FPU, 512 KB Flash, 128 KB Internal RAM, 82 I/Os, 100-Pin LQFP, -40 to 85 degC, Tray; Supply Voltage(Vcc) min (V): 1.71; Operating Frequency(F) (Processor speed) (MHz): 80; I/Os (High Current): 82; FLASH Size (Prog) (kB): 512; Internal RAM Size (kB): 128; D/A Converter: 2; Package Reference: LQFP100; ComponentLink1Description: Manufacturer URL; DatasheetVersion: Rev. 4; ComponentLink1URL: http://www.st.com/; Core: ARM Cortex-M4; ComponentLink2URL: http://www.st.com/st-web-ui/static/active/en/resource/technical/document/datasheet/DM00108832.pdf; Package Description: 100-Pin Low Profile Quad Flat Package, Body 14 x 14 mm, Pitch 0.5 mm; Mounting Technology: Surface Mount; ComponentLink2Description: Datasheet; Packing: Tray; PartId: 1; manid: STM32L452VET6
Y1 = Crystal4: Rezonator: kwarcowy; manid: 3225-12M-SR
Y2 = XTAL_PAD: Crystal Oscillator; manid: 38-HX5F12.5-32.768KHZ

## Sheet connectors.SchDoc: Test
size A4; DrawnBy: Łukasz Przeniosło; Organization: Apptimia sp. z o.o.; Address1: Wojska Polskiego 184c/4; Address2: 71-256 Szczecin; Address3: www.apptimia.com; DocumentNumber: 2; Revision: 1; SheetNumber: 2; SheetTotal: 12
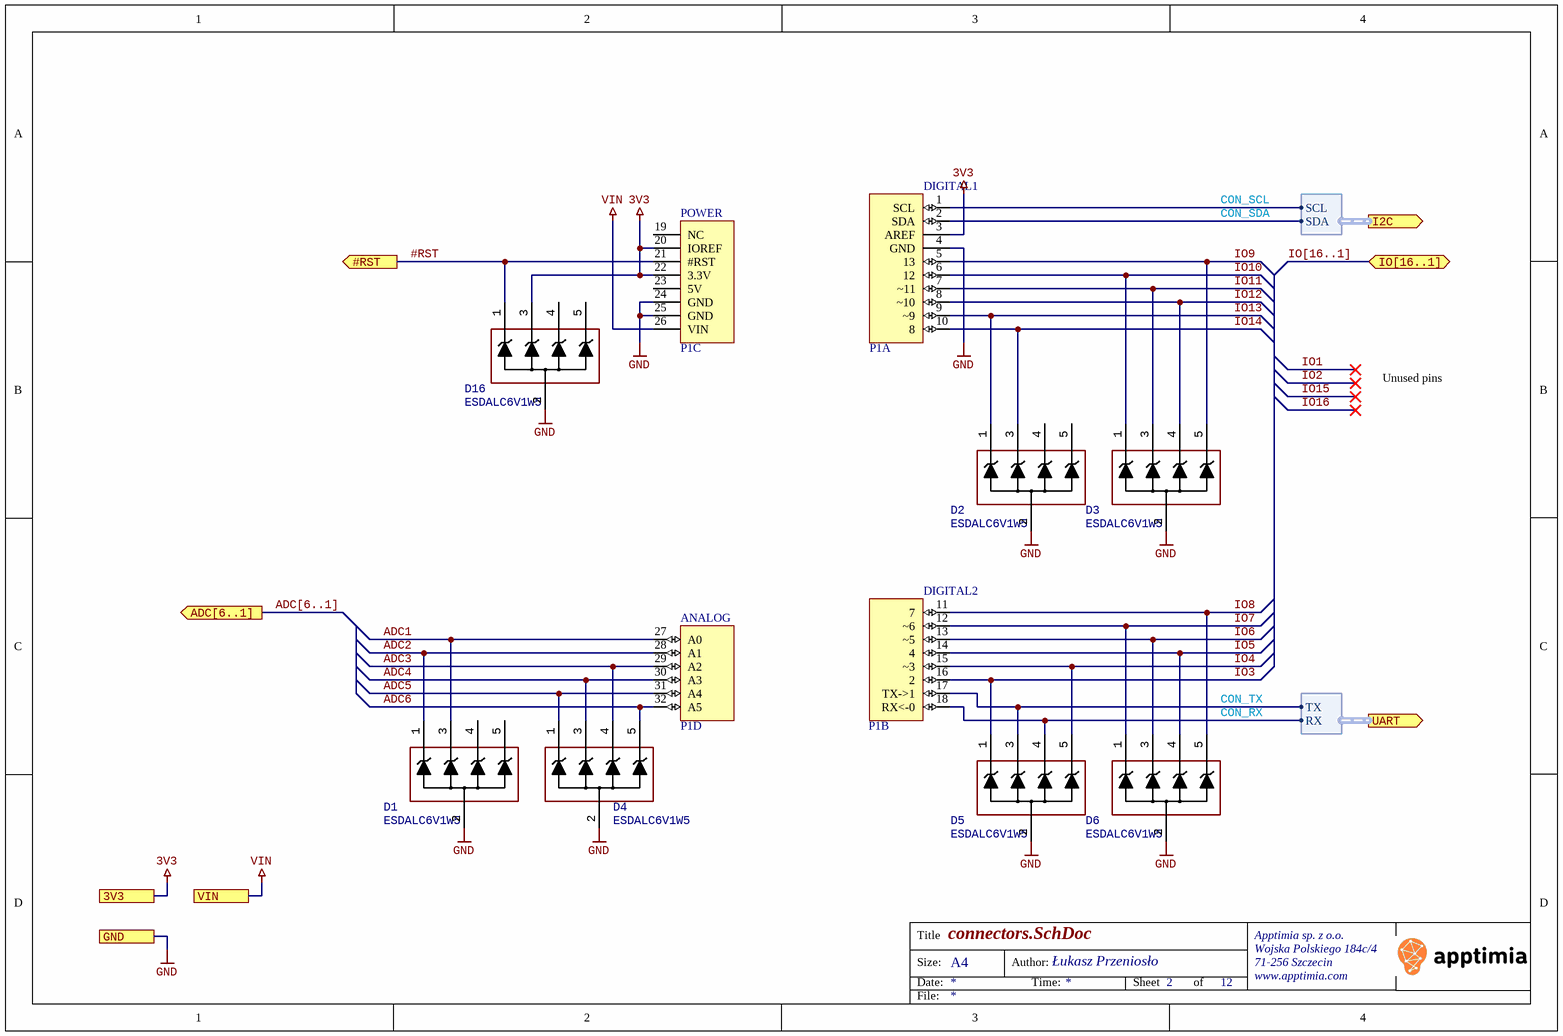
[diagram p8: connectors.SchDoc]

### Parts
D1  ESDALC6V1W5  [SOT323-5L]
D2  ESDALC6V1W5  [SOT323-5L]
D3  ESDALC6V1W5  [SOT323-5L]
D4  ESDALC6V1W5  [SOT323-5L]
D5  ESDALC6V1W5  [SOT323-5L]
D6  ESDALC6V1W5  [SOT323-5L]
D16  ESDALC6V1W5  [SOT323-5L]
P1  NUCLEO-CAPE  [ARDUINO_UNO_HEADER_NOSPI]  (value not drawn)  (parts A,B,C,D of 4)

### Ports
3V3, #RST (out), ADC[6..1] (out), GND, I2C (out, harness I2C), IO[16..1] (bidir), UART (out, harness UART), VIN

### Harnesses
I2C: SCL, SDA
UART: TX, RX

### Nets
3V3: D16.3 P1.3(AREF) P1.20(IOREF) P1.22(3.3V) ; port 3V3  [project net VCC]
GND: D1.2 D2.2 D3.2 D4.2 D5.2 D6.2 D16.2 P1.4(GND) P1.24(GND) P1.25(GND) ; port GND
VIN: P1.26(VIN) ; port VIN  [project net VUSB]
#RST: D16.1 P1.21(#RST) ; port #RST  [project net #MR]
ADC1: D1.3 P1.27(A0)
ADC2: D1.1 P1.28(A1)
ADC3: D4.4 P1.29(A2)
ADC4: D4.3 P1.30(A3)
ADC5: D4.1 P1.31(A4)
ADC6: D4.5 P1.32(A5)
CON_RX: D5.4 P1.18(RX<-0) ; port UART.RX
CON_SCL: P1.1(SCL) ; port I2C.SCL
CON_SDA: P1.2(SDA) ; port I2C.SDA
CON_TX: D5.3 P1.17(TX->1) ; port UART.TX
IO3: D5.1 P1.16(2)
IO4: D5.5 P1.15(~3)
IO5: D6.4 P1.14(4)
IO6: D6.3 P1.13(~5)
IO7: D6.1 P1.12(~6)
IO8: D6.5 P1.11(7)
IO9: D3.5 P1.5(13)
IO10: D3.1 P1.6(12)
IO11: D3.3 P1.7(~11)
IO12: D3.4 P1.8(~10)
IO13: D2.1 P1.9(~9)
IO14: D2.3 P1.10(8)

Not connected (* = marked no-connect by the designer): D1 4 5; D2 4 5; D16 4 5; P1 19(NC) 23(5V)

### Buses and harness runs
bus ADC[6..1] = port ADC[6..1]
bus IO[16..1] = port IO[16..1]

### Notes on the sheet
- Unused pins
- Title
- Size:
- Date:
- A4
- Author:
- Time:
- Sheet
- of
- File:
- (in symbol Nucleo-headers, part A) DIGITAL1
- (in symbol Nucleo-headers, part B) DIGITAL2
- (in symbol Nucleo-headers, part C) POWER
- (in symbol Nucleo-headers, part D) ANALOG

### Library data of the parts
P1 = Nucleo-headers: Arduino header
D1-D6 D16 = ESDALC6V1W5: manid: ESDALC6V1W5

## Sheet reset.SchDoc: Test
size A4; DrawnBy: Łukasz Przeniosło; Organization: Apptimia sp. z o.o.; Address1: Wojska Polskiego 184c/4; Address2: 71-256 Szczecin; Address3: www.apptimia.com; DocumentNumber: 10; Revision: 1; SheetNumber: 10; SheetTotal: 12
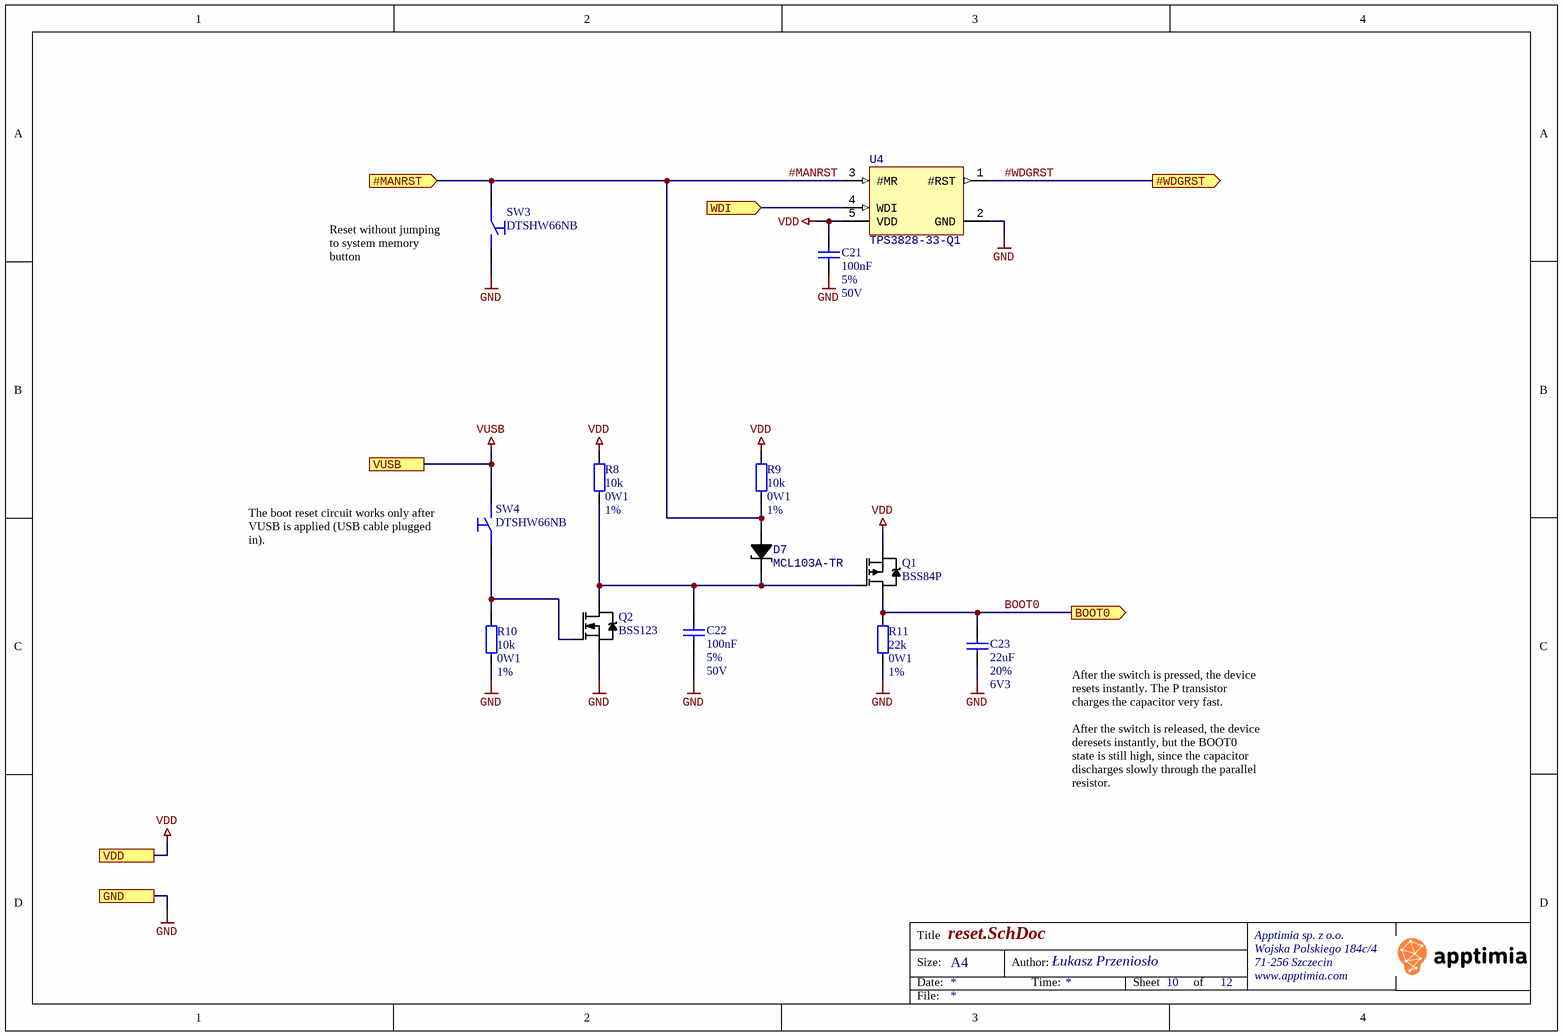
[diagram p9: reset.SchDoc]

### Parts
C21  100nF  Tolerance: 5%  Voltage: 50V  [CAPC1608N]
C22  100nF  Tolerance: 5%  Voltage: 50V  [CAPC1608N]
C23  22uF  Tolerance: 20%  Voltage: 6V3  [CAPC2012N]
D7  MCL103A-TR  [micro-melf]
Q1  BSS84P  [SOT23-3L]
Q2  BSS123  [sot23-3l]
R8  10k  Power: 0W1  Tolerance: 1%  [RESC1608N]
R9  10k  Power: 0W1  Tolerance: 1%  [RESC1608N]
R10  10k  Power: 0W1  Tolerance: 1%  [RESC1608N]
R11  22k  Power: 0W1  Tolerance: 1%  [RESC1608N]
SW3  DTSHW66NB  [FSM2J]
SW4  DTSHW66NB  [FSM2J]
U4  TPS3828-33-Q1  [SOT23-5_N]

### Ports
#MANRST (in), #WDGRST (out), BOOT0 (out), GND, VDD, VUSB, WDI (in)

### Nets
GND: C21.1 C22.2 C23.2 Q2.2(S) R10.2 R11.2 SW3.2 U4.2(GND) ; port GND
VDD: C21.2 Q1.2(S) R8.1 R9.1 U4.5(VDD) ; port VDD  [project net VCC]
VUSB: SW4.2 ; port VUSB
#MANRST: D7.2(A) R9.2 SW3.1 U4.3(#MR) ; port #MANRST  [project net #MR]
#WDGRST: U4.1(#RST) ; port #WDGRST  [project net #MCU_RST]
BOOT0: C23.1 Q1.3(D) R11.1 ; port BOOT0
WDI: U4.4(WDI) ; port WDI
NetC22_1: C22.1 D7.1(K) Q1.1(G) Q2.3(D) R8.2
NetQ2_1: Q2.1(G) R10.1 SW4.1

### Notes on the sheet
- (near SW3) Reset without jumping to system memory button
- The boot reset circuit works only after VUSB is applied (USB cable plugged in).
- After the switch is pressed, the device resets instantly. The P transistor charges the capacitor very fast.
  After the switch is released, the device deresets instantly, but the BOOT0 state is still high, since the capacitor discharges slowly through the parallel resistor.
- Title
- Size:
- Date:
- A4
- Author:
- Time:
- Sheet
- of
- File:

### Library data of the parts
C21-C23 = Capacitor
  C21 C22: Value: 100nF
  C23: Value: 22uF
D7 = MCL103: Shotky Diode; manid: MCL103A-TR
R8-R11 = Resistor
  R8-R10: Value: 10k
  R11: Value: 22k
SW3 SW4 = DTSHW66NB: SWITCH, SPNO TACT; Published: 8-Jun-2000; LatestRevisionDate: 17-Jul-2002; LatestRevisionNote: Re-released for DXP Platform.; PackageDocument: Sep-1998; PackageReference: SOT-23A; Publisher: Altium Limited; ComponentLink1Description: Manufacturer Link; ComponentLink2Description: Datasheet; Distributor: tme.pl; tme.pl: DTSHW66NB
U4 = TPS3828-xx-Q1: TPS382x-xx-Q1 Voltage Monitor With Watchdog Timer; manid: TPS3828-33-Q1
Q1 = BSS84P: manid: BSS84P
Q2 = BSS123: manid: BSS123

## Sheet rgb.SchDoc: Test
size A4; DrawnBy: Łukasz Przeniosło; Organization: Apptimia sp. z o.o.; Address1: Wojska Polskiego 184c/4; Address2: 71-256 Szczecin; Address3: www.apptimia.com; DocumentNumber: 11; Revision: 1; SheetNumber: 11; SheetTotal: 12
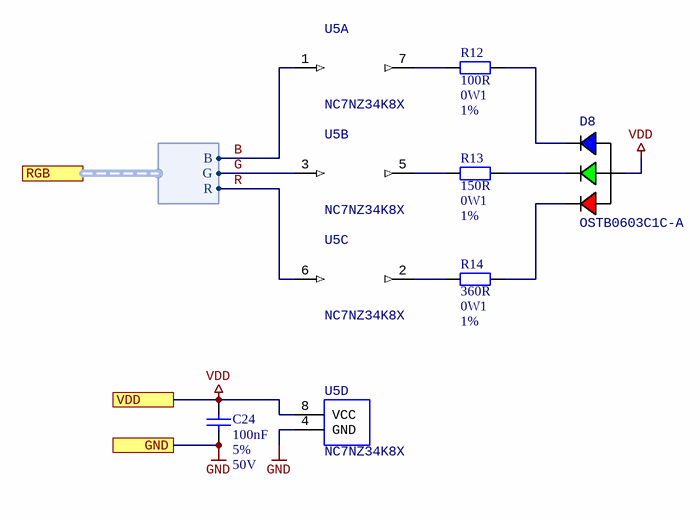
[diagram p10: rgb.SchDoc]

### Parts
C24  100nF  Tolerance: 5%  Voltage: 50V  [CAPC1608N]
D8  OSTB0603C1C-A  [RGB-0603]
R12  100R  Power: 0W1  Tolerance: 1%  [RESC1608N]
R13  150R  Power: 0W1  Tolerance: 1%  [RESC1608N]
R14  360R  Power: 0W1  Tolerance: 1%  [RESC1608N]
U5  NC7NZ34K8X  [US8]  (parts A,B,C,D of 4)

### Ports
GND, RGB (harness RGB), VDD

### Harnesses
RGB: B, G, R

### Nets
GND: C24.2 U5.4(GND) ; port GND
VDD: C24.1 D8.1(A) U5.8(VCC) ; port VDD  [project net VCC]
B: U5.1(1A) ; port RGB.B
G: U5.3(2A) ; port RGB.G
R: U5.6(3A) ; port RGB.R
NetD8_2: D8.2(KRED) R14.1
NetD8_3: D8.3(KBLU) R12.1
NetD8_4: D8.4(KGRN) R13.1
NetR12_2: R12.2 U5.7(1Y)
NetR13_2: R13.2 U5.5(2Y)
NetR14_2: R14.2 U5.2(3Y)

### Notes on the sheet
- Title
- Size:
- Date:
- A4
- Author:
- Time:
- Sheet
- of
- File:

### Library data of the parts
C24 = Capacitor: Value: 100nF
D8 = RGB0603: manid: OSTB0603C1C-A
R12-R14 = Resistor
  R12: Value: 100R
  R13: Value: 150R
  R14: Value: 360R
U5 = NC7NZ34: Trible buffer; manid: NC7NZ34K8X

## Sheet io-expander.SchDoc: Test
size A4; DrawnBy: Łukasz Przeniosło; Organization: Apptimia sp. z o.o.; Address1: Wojska Polskiego 184c/4; Address2: 71-256 Szczecin; Address3: www.apptimia.com; DocumentNumber: 12; Revision: 1; SheetNumber: 12; SheetTotal: 12
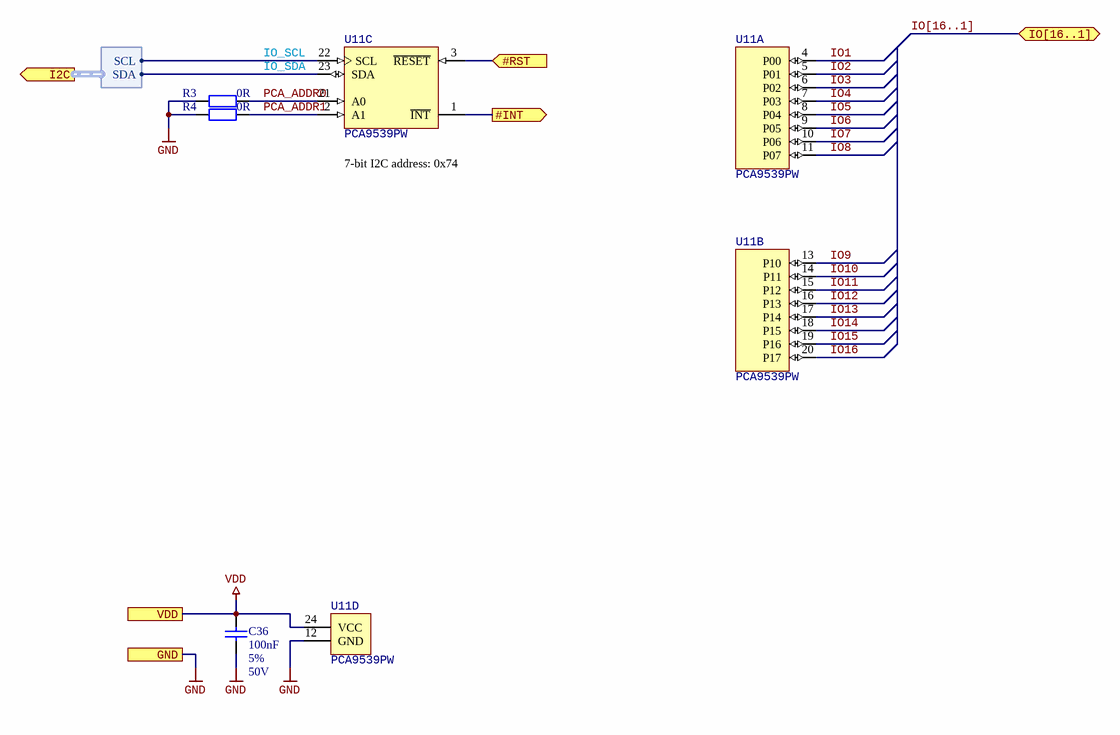
[diagram p11: io-expander.SchDoc]

### Parts
C36  100nF  Tolerance: 5%  Voltage: 50V  [CAPC1608N]
R3  0R  [RESC1005N]
R4  0R  [RESC1005N]
U11  PCA9539PW  [TSSOP24_L]  (parts A,B,C,D of 4)

### Ports
#INT (out), #RST (in), GND, I2C (out, harness I2C), IO[16..1] (bidir), VDD

### Harnesses
I2C: SCL, SDA

### Nets
GND: C36.1 R3.1 R4.1 U11.12(GND) ; port GND
VDD: C36.2 U11.24(VCC) ; port VDD  [project net VCC]
#I2CINT_IOEXP: U11.1(~{INT}) ; port #INT
#MCU_RST: U11.3(~{RESET}) ; port #RST
IO1: U11.4(P00)
IO2: U11.5(P01)
IO3: U11.6(P02)
IO4: U11.7(P03)
IO5: U11.8(P04)
IO6: U11.9(P05)
IO7: U11.10(P06)
IO8: U11.11(P07)
IO9: U11.13(P10)
IO10: U11.14(P11)
IO11: U11.15(P12)
IO12: U11.16(P13)
IO13: U11.17(P14)
IO14: U11.18(P15)
IO15: U11.19(P16)
IO16: U11.20(P17)
IO_SCL: U11.22(SCL) ; port I2C.SCL  [project net CON_SCL]
IO_SDA: U11.23(SDA) ; port I2C.SDA  [project net CON_SDA]
PCA_ADDR0: R3.2 U11.21(A0)
PCA_ADDR1: R4.2 U11.2(A1)

### Buses and harness runs
bus IO[16..1] = port IO[16..1]

### Notes on the sheet
- (near U11) 7-bit I2C address: 0x74
- Title
- Size:
- Date:
- A4
- Author:
- Time:
- Sheet
- of
- File:

### Library data of the parts
C36 = Capacitor: Value: 100nF
R3 R4 = Resistor: Power: 0W1; Tolerance: 5%; Value: 0R
U11 = PCA9539: 16-bit I 2 C-bus and SMBus low power I/O port with interrupt and reset; manid: PCA9539PW

## Nets that join several sheets
GND: top (CON1.5 CON1.7 SW1.1), power-io (9 pins), usbc (24 pins), usb-i2c-uart (C27.1 C28.1 C29.1 U8.13), sram (C26.1 U7.4), rom (C25.1 U6.4), emmc (20 pins), mcu (22 pins), connectors (10 pins), reset (8 pins), rgb (C24.2 U5.4), io-expander (C36.1 R3.1 R4.1 U11.12)
VCC: top (CON1.3), power-io (5 pins), usbc (R22.2), usb-i2c-uart (7 pins), sram (C26.2 U7.7 U7.8), rom (C25.2 U6.8), emmc (16 pins), mcu (16 pins), connectors (D16.3 P1.3 P1.20 P1.22), reset (5 pins), rgb (C24.1 D8.1 U5.8), io-expander (C36.2 U11.24)
VUSB: power-io (C19.2 U3.2), usbc (9 pins), connectors (P1.26), reset (SW4.2)
#CS: sram (U7.1), mcu (U2.81)
#EMMC_RST: emmc (U1.J1 U1.J2 U1.J3 U1.K5), mcu (U2.77)
#I2CINT_IOEXP: mcu (U2.33), io-expander (U11.1)
#I2CINT_USBC: usbc (U9.19), mcu (U2.16)
#MCU_RST: mcu (U2.14), reset (U4.1), io-expander (U11.3)
#MR: top (CON1.12), connectors (D16.1 P1.21), reset (D7.2 R9.2 SW3.1 U4.3)
#QCS: rom (U6.1), mcu (U2.42)
#USRBTN: top (SW1.2), mcu (U2.35)
ADC1: mcu (U2.23), connectors (D1.3 P1.27)
ADC2: mcu (U2.24), connectors (D1.1 P1.28)
ADC3: mcu (U2.29), connectors (D4.4 P1.29)
ADC4: mcu (U2.30), connectors (D4.3 P1.30)
ADC5: mcu (U2.31), connectors (D4.1 P1.31)
ADC6: mcu (U2.32), connectors (D4.5 P1.32)
B: mcu (U2.3), rgb (U5.1)
BOOT0: mcu (U2.94), reset (C23.1 Q1.3 R11.1)
CLK: emmc (U1.M6 U1.M7 U1.N7 U1.P7), mcu (U2.80)
CMD: emmc (U1.L1 U1.L2 U1.L3 U1.M5), mcu (U2.83)
CON_RX: mcu (U2.69), connectors (D5.4 P1.18)
CON_SCL: usbc (U9.7), usb-i2c-uart (U8.8), mcu (R2.1 U2.92), connectors (P1.1), io-expander (U11.22)
CON_SDA: usbc (U9.8), usb-i2c-uart (U8.9), mcu (R1.1 U2.93), connectors (P1.2), io-expander (U11.23)
CON_TX: mcu (U2.68), connectors (D5.3 P1.17)
DAT1: emmc (U1.A3), mcu (U2.65)
DAT2: emmc (U1.A4), mcu (U2.66)
DAT3: emmc (U1.A5), mcu (U2.78)
DAT4: emmc (U1.A2 U1.B2), mcu (U2.79)
DBGRX: top (CON1.14), mcu (U2.47)
DBGTX: top (CON1.13), mcu (U2.48)
G: mcu (U2.4), rgb (U5.3)
IO3: connectors (D5.1 P1.16), io-expander (U11.6)
IO4: connectors (D5.5 P1.15), io-expander (U11.7)
IO5: connectors (D6.4 P1.14), io-expander (U11.8)
IO6: connectors (D6.3 P1.13), io-expander (U11.9)
IO7: connectors (D6.1 P1.12), io-expander (U11.10)
IO8: connectors (D6.5 P1.11), io-expander (U11.11)
IO9: connectors (D3.5 P1.5), io-expander (U11.13)
IO10: connectors (D3.1 P1.6), io-expander (U11.14)
IO11: connectors (D3.3 P1.7), io-expander (U11.15)
IO12: connectors (D3.4 P1.8), io-expander (U11.16)
IO13: connectors (D2.1 P1.9), io-expander (U11.17)
IO14: connectors (D2.3 P1.10), io-expander (U11.18)
MCPMASTER: usb-i2c-uart (R6.8), mcu (U2.18)
MCUACK: usb-i2c-uart (R6.2), mcu (U2.51)
MCUMASTER: usb-i2c-uart (R6.6), mcu (U2.17)
MISO: sram (U7.2), mcu (U2.84)
MOSI: sram (U7.5), mcu (U2.85)
QCLK: rom (U6.6), mcu (U2.41)
QSIO1: rom (U6.5), mcu (U2.43)
QSIO2: rom (U6.2), mcu (U2.44)
QSIO3: rom (U6.3), mcu (U2.45)
QSIO4: rom (U6.7), mcu (U2.46)
R: mcu (U2.5), rgb (U5.6)
RX: usb-i2c-uart (U8.5), mcu (U2.26)
SCK: sram (U7.6), mcu (U2.82)
SWCLK: top (CON1.6), mcu (U2.76)
SWDIO: top (CON1.4), mcu (U2.72)
SWO: top (CON1.8), mcu (U2.89)
TX: usb-i2c-uart (U8.4), mcu (U2.25)
USB_N: usbc (R19.1), usb-i2c-uart (U8.11)
USB_P: usbc (R18.1), usb-i2c-uart (U8.12)
USBPG: power-io (U3.3), usbc (U10.4)
WDI: mcu (U2.15), reset (U4.4)